# EAGLE board jopcore (EAGLE 4.08), part 1 of 2
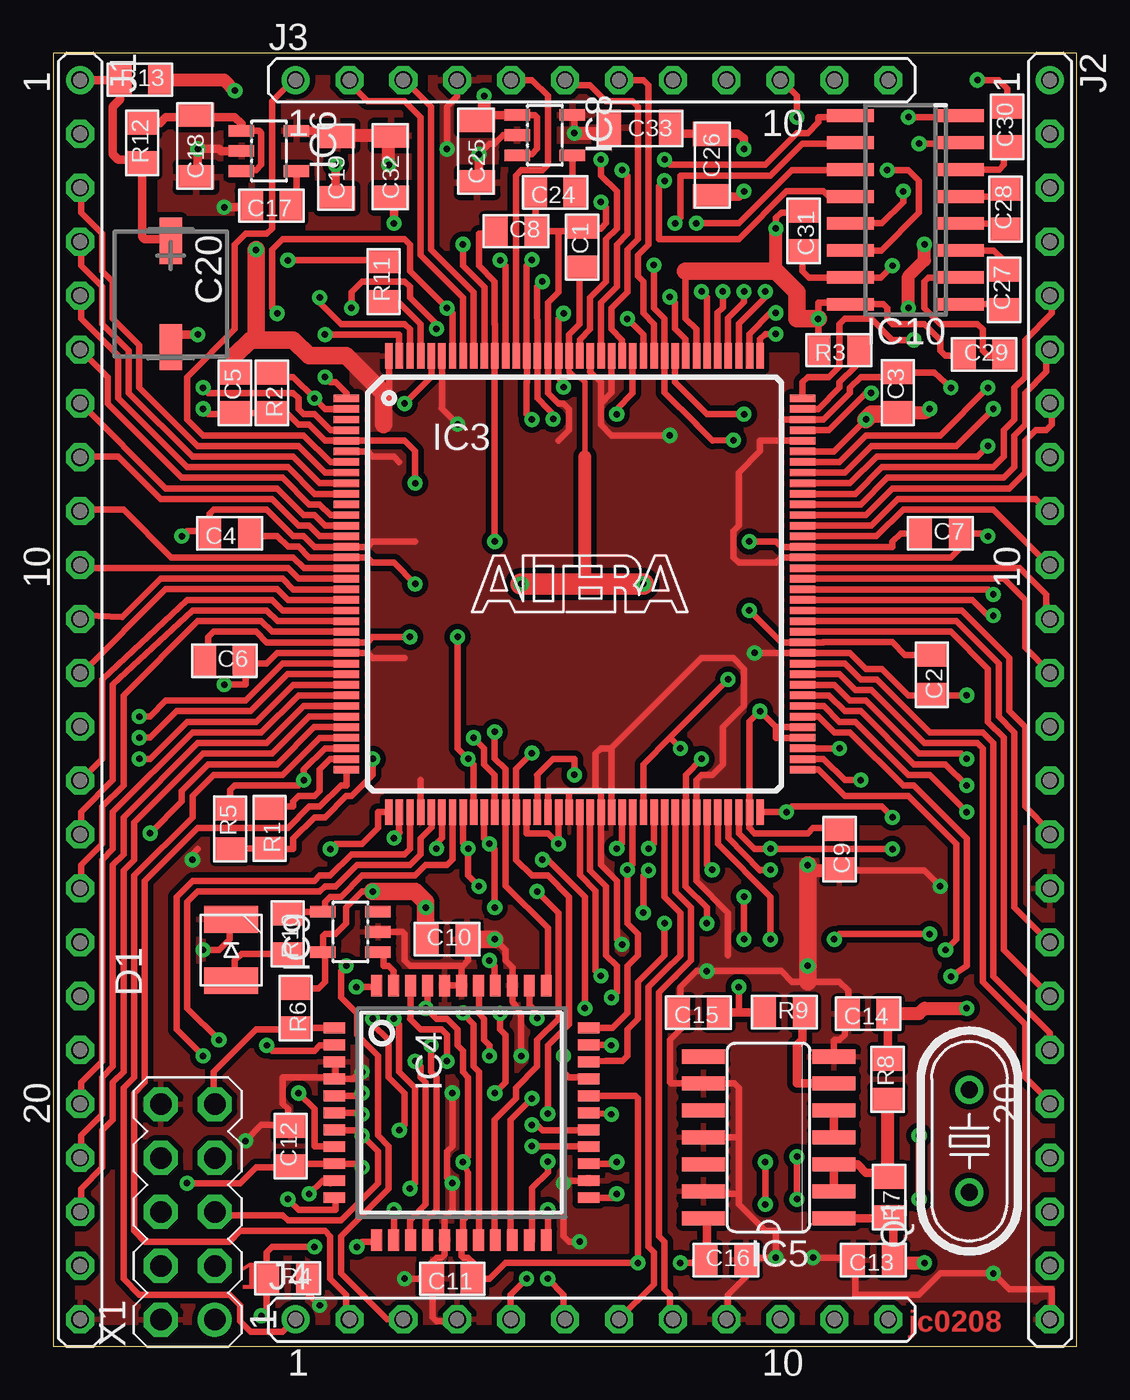
[diagram p1: board, top side]
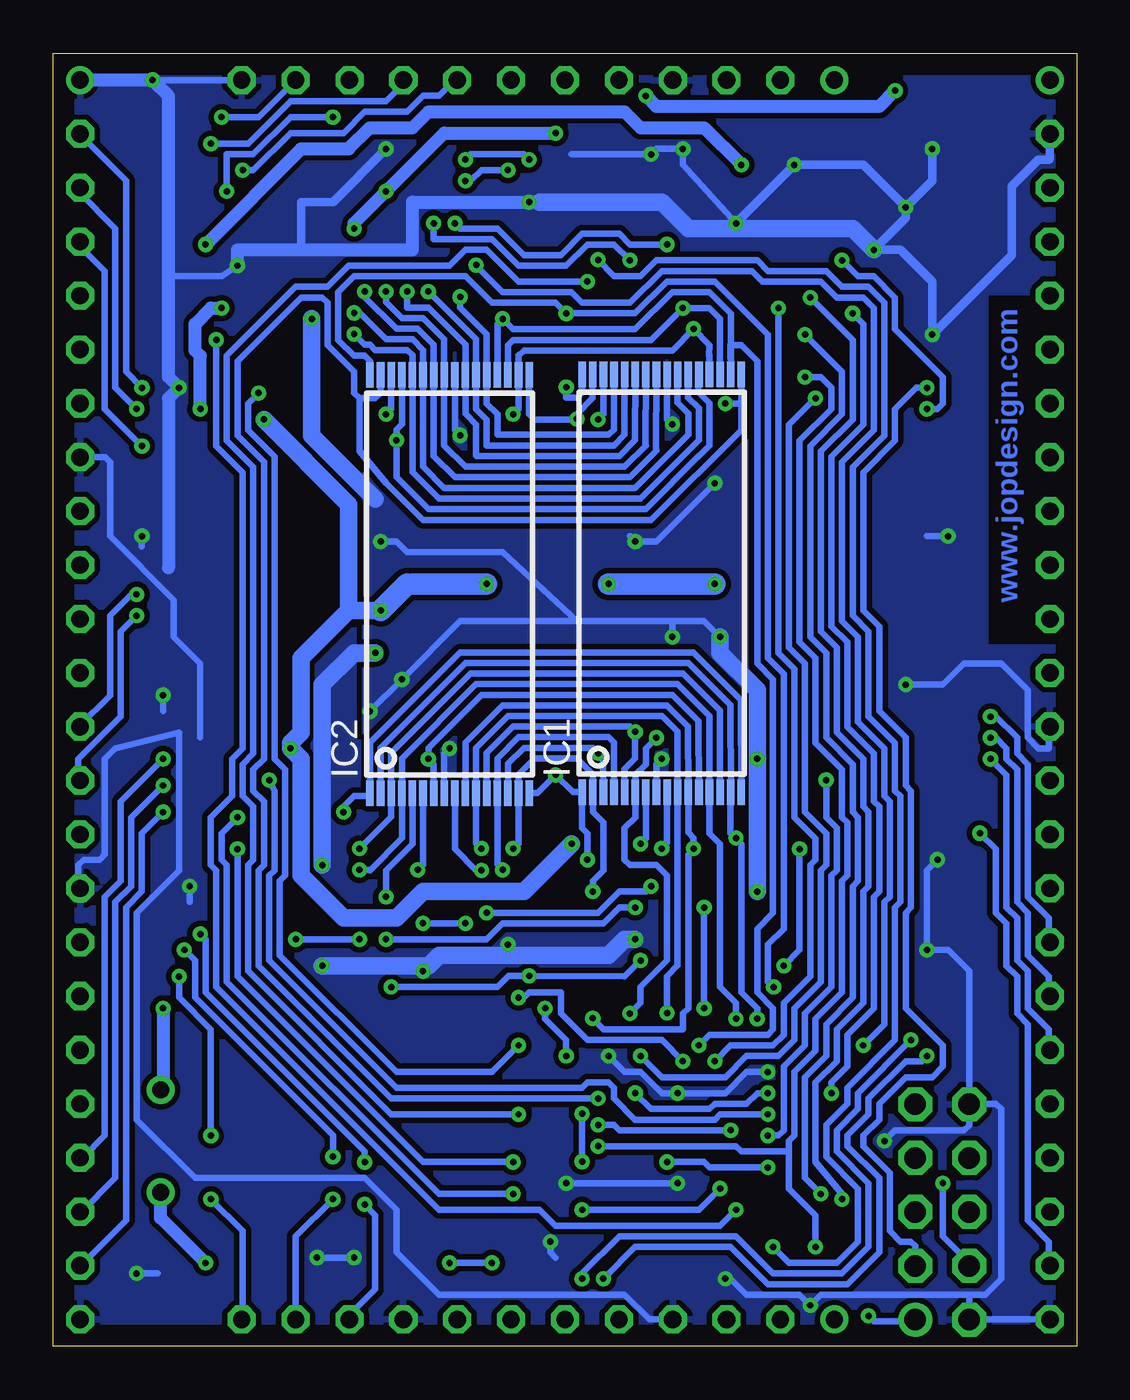
[diagram p2: board, bottom side, seen from below]

Size 48.26 x 60.96 mm. Coordinates in mm from the lower left corner, seen from the top.
Outline: 0,60.96 0,0 48.26,0 48.26,60.96 0,60.96
Copper layers used: Top, Bottom

## Footprints (pad centres in the part's own frame; a part is rotated, then mirrored left to right if it is on the bottom)
0805 = smd 1.092 x 1.397: 1 -0.94,0; 2 0.94,0
1206 = smd 1.143 x 1.702: 1 -1.473,0; 2 1.473,0
CE-C = smd 2.184 x 1.067: + -2.5,0; - 2.5,0
LED = smd 1.27 x 2.54: 1 -1.44,0; 2 1.44,0
TSOP32 = smd 1.2 x 0.36: 1 -9.85,3.75; 2 -9.85,3.25; 3 -9.85,2.75; 4 -9.85,2.25; 5 -9.85,1.75; 6 -9.85,1.25; 7 -9.85,0.75; 8 -9.85,0.25; 9 -9.85,-0.25; 10 -9.85,-0.75; 11 -9.85,-1.25; 12 -9.85,-1.75; 13 -9.85,-2.25; 14 -9.85,-2.75; 15 -9.85,-3.25; 16 -9.85,-3.75; 17 9.85,-3.75; 18 9.85,-3.25; 19 9.85,-2.75; 20 9.85,-2.25; 21 9.85,-1.75; 22 9.85,-1.25; 23 9.85,-0.75; 24 9.85,-0.25; 25 9.85,0.25; 26 9.85,0.75; 27 9.85,1.25; 28 9.85,1.75; 29 9.85,2.25; 30 9.85,2.75; 31 9.85,3.25; 32 9.85,3.75
TQFP144 = smd 1.2 x 0.35: 1 -10.75,8.75; 2 -10.75,8.25; 3 -10.75,7.75; 4 -10.75,7.25; 5 -10.75,6.75; 6 -10.75,6.25; 7 -10.75,5.75; 8 -10.75,5.25; 9 -10.75,4.75; 10 -10.75,4.25; 11 -10.75,3.75; 12 -10.75,3.25; 13 -10.75,2.75; 14 -10.75,2.25; 15 -10.75,1.75; 16 -10.75,1.25; 17 -10.75,0.75; 18 -10.75,0.25; 19 -10.75,-0.25; 20 -10.75,-0.75; 21 -10.75,-1.25; 22 -10.75,-1.75; 23 -10.75,-2.25; 24 -10.75,-2.75; 25 -10.75,-3.25; 26 -10.75,-3.75; 27 -10.75,-4.25; 28 -10.75,-4.75; 29 -10.75,-5.25; 30 -10.75,-5.75; 31 -10.75,-6.25; 32 -10.75,-6.75; 33 -10.75,-7.25; 34 -10.75,-7.75; 35 -10.75,-8.25; 36 -10.75,-8.75; 73 10.75,-8.75; 74 10.75,-8.25; 75 10.75,-7.75; 76 10.75,-7.25; 77 10.75,-6.75; 78 10.75,-6.25; 79 10.75,-5.75; 80 10.75,-5.25; 81 10.75,-4.75; 82 10.75,-4.25; 83 10.75,-3.75; 84 10.75,-3.25; 85 10.75,-2.75; 86 10.75,-2.25; 87 10.75,-1.75; 88 10.75,-1.25; 89 10.75,-0.75; 90 10.75,-0.25; 91 10.75,0.25; 92 10.75,0.75; 93 10.75,1.25; 94 10.75,1.75; 95 10.75,2.25; 96 10.75,2.75; 97 10.75,3.25; 98 10.75,3.75; 99 10.75,4.25; 100 10.75,4.75; 101 10.75,5.25; 102 10.75,5.75; 103 10.75,6.25; 104 10.75,6.75; 105 10.75,7.25; 106 10.75,7.75; 107 10.75,8.25; 108 10.75,8.75 | smd 0.35 x 1.2: 37 -8.75,-10.75; 38 -8.25,-10.75; 39 -7.75,-10.75; 40 -7.25,-10.75; 41 -6.75,-10.75; 42 -6.25,-10.75; 43 -5.75,-10.75; 44 -5.25,-10.75; 45 -4.75,-10.75; 46 -4.25,-10.75; 47 -3.75,-10.75; 48 -3.25,-10.75; 49 -2.75,-10.75; 50 -2.25,-10.75; 51 -1.75,-10.75; 52 -1.25,-10.75; 53 -0.75,-10.75; 54 -0.25,-10.75; 55 0.25,-10.75; 56 0.75,-10.75; 57 1.25,-10.75; 58 1.75,-10.75; 59 2.25,-10.75; 60 2.75,-10.75; 61 3.25,-10.75; 62 3.75,-10.75; 63 4.25,-10.75; 64 4.75,-10.75; 65 5.25,-10.75; 66 5.75,-10.75; 67 6.25,-10.75; 68 6.75,-10.75; 69 7.25,-10.75; 70 7.75,-10.75; 71 8.25,-10.75; 72 8.75,-10.75; 109 8.75,10.75; 110 8.25,10.75; 111 7.75,10.75; 112 7.25,10.75; 113 6.75,10.75; 114 6.25,10.75; 115 5.75,10.75; 116 5.25,10.75; 117 4.75,10.75; 118 4.25,10.75; 119 3.75,10.75; 120 3.25,10.75; 121 2.75,10.75; 122 2.25,10.75; 123 1.75,10.75; 124 1.25,10.75; 125 0.75,10.75; 126 0.25,10.75; 127 -0.25,10.75; 128 -0.75,10.75; 129 -1.25,10.75; 130 -1.75,10.75; 131 -2.25,10.75; 132 -2.75,10.75; 133 -3.25,10.75; 134 -3.75,10.75; 135 -4.25,10.75; 136 -4.75,10.75; 137 -5.25,10.75; 138 -5.75,10.75; 139 -6.25,10.75; 140 -6.75,10.75; 141 -7.25,10.75; 142 -7.75,10.75; 143 -8.25,10.75; 144 -8.75,10.75
TQFP44 = smd 0.508 x 1.016: 1 -4,-6; 2 -3.2,-6; 3 -2.4,-6; 4 -1.6,-6; 5 -0.8,-6; 6 0,-6; 7 0.8,-6; 8 1.6,-6; 9 2.4,-6; 10 3.2,-6; 11 4,-6; 23 4,6; 24 3.2,6; 25 2.4,6; 26 1.6,6; 27 0.8,6; 28 0,6; 29 -0.8,6; 30 -1.6,6; 31 -2.4,6; 32 -3.2,6; 33 -4,6 | smd 1.016 x 0.508: 12 6,-4; 13 6,-3.2; 14 6,-2.4; 15 6,-1.6; 16 6,-0.8; 17 6,0; 18 6,0.8; 19 6,1.6; 20 6,2.4; 21 6,3.2; 22 6,4; 34 -6,4; 35 -6,3.2; 36 -6,2.4; 37 -6,1.6; 38 -6,0.8; 39 -6,0; 40 -6,-0.8; 41 -6,-1.6; 42 -6,-2.4; 43 -6,-3.2; 44 -6,-4
SO14 = smd 0.66 x 2.032: 1 -3.81,-3.073; 2 -2.54,-3.073; 3 -1.27,-3.073; 4 0,-3.073; 5 1.27,-3.073; 6 2.54,-3.073; 7 3.81,-3.073; 8 3.81,3.073; 9 2.54,3.073; 10 1.27,3.073; 11 0,3.073; 12 -1.27,3.073; 13 -2.54,3.073; 14 -3.81,3.073
SOT23-5 = smd 0.55 x 1.2: 1 -0.95,-1.3; 2 0,-1.3; 3 0.95,-1.3; 4 0.95,1.3; 5 -0.95,1.3
SO16 = smd 0.6 x 2.2: 1 -4.445,-2.6; 2 -3.175,-2.6; 3 -1.905,-2.6; 4 -0.635,-2.6; 5 0.635,-2.6; 6 1.905,-2.6; 7 3.175,-2.6; 8 4.445,-2.6; 9 4.445,2.6; 10 3.175,2.6; 11 1.905,2.6; 12 0.635,2.6; 13 -0.635,2.6; 14 -1.905,2.6; 15 -3.175,2.6; 16 -4.445,2.6
CON24 = drill 0.813 round: 1 -27.94,0 | drill 0.813 octagon: 2 -25.4,0; 3 -22.86,0; 4 -20.32,0; 5 -17.78,0; 6 -15.24,0; 7 -12.7,0; 8 -10.16,0; 9 -7.62,0; 10 -5.08,0; 11 -2.54,0; 12 0,0; 13 2.54,0; 14 5.08,0; 15 7.62,0; 16 10.16,0; 17 12.7,0; 18 15.24,0; 19 17.78,0; 20 20.32,0; 21 22.86,0; 22 25.4,0; 23 27.94,0; 24 30.48,0
CON12 = drill 0.813 round: 1 -12.7,0 | drill 0.813 octagon: 2 -10.16,0; 3 -7.62,0; 4 -5.08,0; 5 -2.54,0; 6 0,0; 7 2.54,0; 8 5.08,0; 9 7.62,0; 10 10.16,0; 11 12.7,0; 12 15.24,0
HC49U-V = drill 0.813 round: 1 -2.413,0; 2 2.413,0
BYTEBLST = drill 1.016 pad 1.6 round: 1 -5.08,-1.27 | drill 1.016 pad 1.6 octagon: 2 -5.08,1.27; 3 -2.54,-1.27; 4 -2.54,1.27; 5 0,-1.27; 6 0,1.27; 7 2.54,-1.27; 8 2.54,1.27; 9 5.08,-1.27; 10 5.08,1.27

## Placement (x,y rotation side)
C1  10n  [0805]  24.94,51.81 270 top
C2  10n  [0805]  41.42,31.66 90 top
C3  10n  [0805]  39.82,44.96 270 top
C4  10n  [0805]  8.32,38.32 0 top
C5  10n  [0805]  8.57,44.94 270 top
C6  10n  [0805]  8.07,32.32 180 top
C7  10n  [0805]  41.82,38.32 180 top
C8  10n  [0805]  21.82,52.56 180 top
C9  10n  [0805]  37.07,23.44 90 top
C10  10n  [0805]  18.57,19.19 180 top
C11  10n  [0805]  18.82,3.19 0 top
C12  10n  [0805]  11.2,9.44 270 top
C13  33p  [0805]  38.67,4.07 0 top
C14  33p  [0805]  38.42,15.68 0 top
C15  33p  [0805]  30.42,15.74 0 top
C16  10n  [0805]  31.72,4.08 180 top
C17  10n  [0805]  10.3,53.77 0 top
C18  2u2  [1206]  6.74,56.58 90 top
C19  2u2  [1206]  13.38,55.58 90 top
C20  10u  [CE-C]  5.55,49.6 270 top
C24  10n  [0805]  23.67,54.39 0 top
C25  2u2  [1206]  19.99,56.33 90 top
C26  2u2  [1206]  31.01,55.67 270 top
C27  100n  [0805]  44.82,49.8 270 top
C28  100n  [0805]  44.89,53.6 270 top
C29  100n  [0805]  43.89,46.75 180 top
C30  100n  [0805]  44.97,57.48 270 top
C31  100n  [0805]  35.38,52.57 90 top
C32  2u2  [1206]  15.94,55.6 90 top
C33  2u2  [1206]  27.67,57.45 180 top
D1  LED  [LED]  8.4,18.68 90 top
IC1  FLASH512K  [TSOP32]  19.57,35.98 90 bottom
IC2  RAM512K  [TSOP32]  29.57,35.94 90 bottom
IC3  JOP  [TQFP144]  24.58,35.94 0 top
IC4  CONFPPA  [TQFP44]  19.25,11.02 270 top
IC5  74HC04D  [SO14]  33.73,9.85 90 top
IC6  LP2985IM5-2V5  [SOT23-5]  10.18,56.34 270 top
IC8  LP2985IM5-3V3  [SOT23-5]  23.18,57.09 270 top
IC9  MAX823  [SOT23-5]  14.02,19.54 90 top
IC10  MAX3232  [SO16]  40.18,53.56 90 top
J1  CON24  [CON24]  1.27,31.75 270 top
J2  CON24  [CON24]  46.99,31.75 270 top
J3  CON12  [CON12]  24.13,59.69 0 top
J4  CON12  [CON12]  24.13,1.27 0 top
Q1  20MHz  [HC49U-V]  43.19,9.68 90 top
R1  1k  [0805]  10.21,24.42 90 top
R2  1k  [0805]  10.32,44.94 90 top
R3  10k  [0805]  37.04,46.96 0 top
R4  1k  [0805]  11.06,3.21 180 top
R5  1k  [0805]  8.35,24.39 270 top
R6  1k  [0805]  11.44,15.94 90 top
R7  1M  [0805]  39.41,7.04 90 top
R8  2k7  [0805]  39.34,12.59 270 top
R9  82  [0805]  34.47,15.75 180 top
R10  680  [0805]  11.06,19.44 90 top
R11  10k  [0805]  15.58,50.19 270 top
R12  4R7  [0805]  4.2,56.72 270 top
R13  4R7  [0805]  4.1,59.7 180 top
X1  BYTEBLST  [BYTEBLST]  6.35,6.34 90 top